# EasyEDA Pro project MSDRV4.eprj, schematic Schematic1_1
Board Name: Board1_1; Create Date: 2025-01-27; Page Name: P1; Project Name: MSDRV4; Schematic Name: Schematic1_1; Update Date: 2025-02-03; Company: EasyEDA.com; Page Size: A4; Version: V1.0
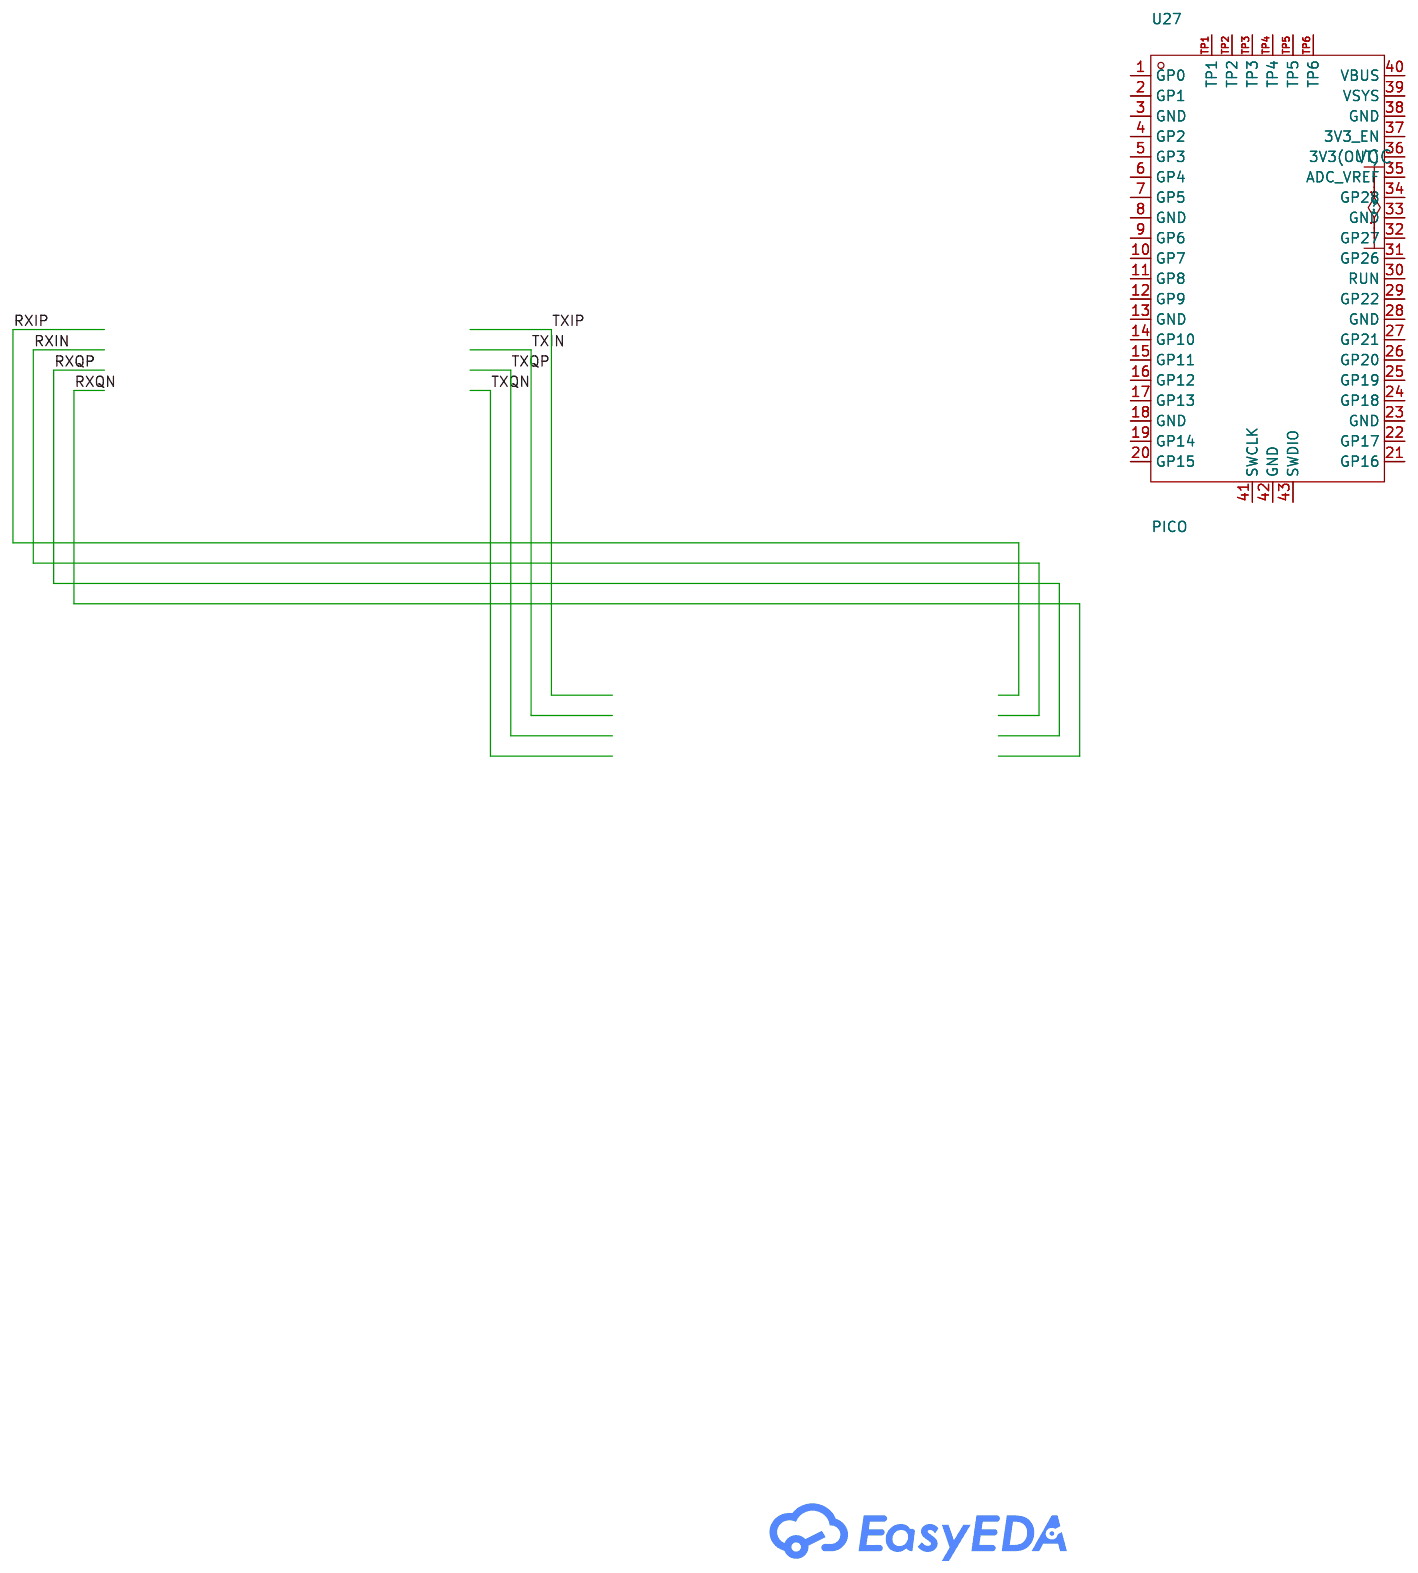
[diagram p3: schematic sheet]

## Parts
CBB1  -
CBB2  -
U27  PICO  [comm-smd_l51.0-w21.0-p2.54_sc0916]

## Library data of the parts
U27 = PICO: Supplier: LCSC; Supplier Part: C7203002; Manufacturer: Raspberry Pi(树莓派); JLCPCB Part Class: Extended Part; Datasheet: https://atta.szlcsc.com/upload/public/pdf/source/20230906/086376002DDC9866828648BC93E51F8B.pdf

## Nets
RXIN: CBB1.(TXQN) CBB2.(RXQN)

Not connected (* = marked no-connect by the designer): U27 1(GP0) 2(GP1) 3(GND) 4(GP2) 5(GP3) 6(GP4) 7(GP5) 8(GND) 9(GP6) 10(GP7) 11(GP8) 12(GP9) 13(GND) 14(GP10) 15(GP11) 16(GP12) 17(GP13) 18(GND) 19(GP14) 20(GP15) 21(GP16) 22(GP17) 23(GND) 24(GP18) 25(GP19) 26(GP20) 27(GP21) 28(GND) 29(GP22) 30(RUN) 31(GP26) 32(GP27) 33(GND) 34(GP28) 35(ADC_VREF) 36(3V3(OUT)) 37(3V3_EN) 38(GND) 39(VSYS) 40(VBUS) 41(SWCLK) 42(GND) 43(SWDIO) TP1 TP2 TP3 TP4 TP5 TP6
